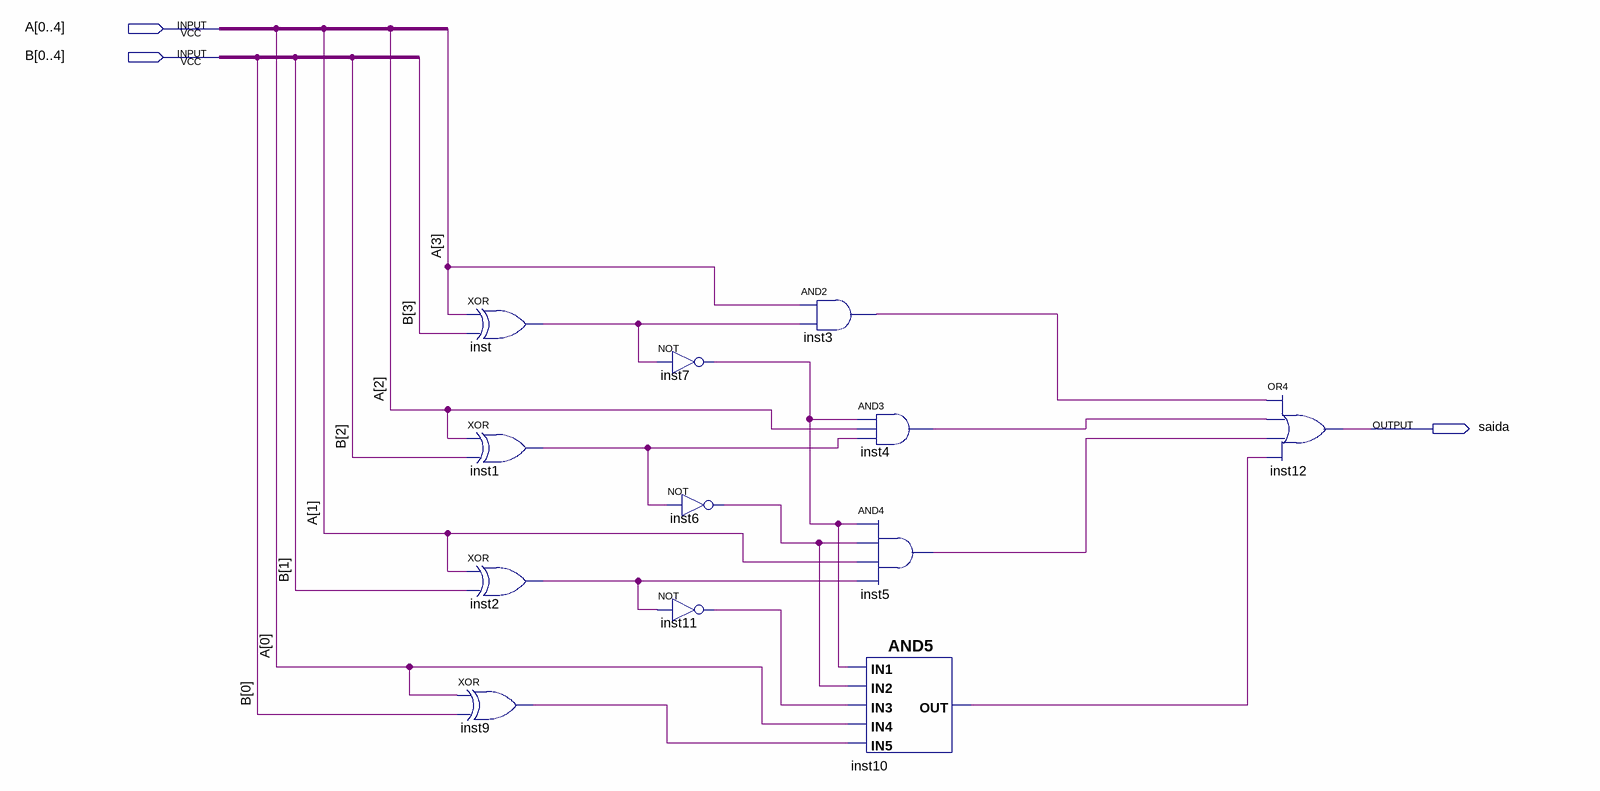
[diagram p0: schematic sheet]
// Quartus schematic Block2.bdf as structural Verilog: 12 symbols, 3 pins
module Block2 (
  input  [0:4] A,
  input  [0:4] B,
  output saida
);

  wire inst1_out, inst2_out, inst3_out, inst4_out, inst5_out, inst6_out, inst7_out, inst9_out, inst10_out,
       inst11_out, inst_out;

  xor inst (inst_out, A[3], B[3]);
  xor inst1 (inst1_out, A[2], B[2]);
  xor inst2 (inst2_out, A[1], B[1]);
  xor inst9 (inst9_out, A[0], B[0]);
  not inst7 (inst7_out, inst_out);
  not inst6 (inst6_out, inst1_out);
  not inst11 (inst11_out, inst2_out);
  and inst3 (inst3_out, A[3], inst_out);
  and inst4 (inst4_out, inst7_out, A[2], inst1_out);
  and inst5 (inst5_out, inst7_out, inst6_out, A[1], inst2_out);
  and inst10 (inst10_out, inst7_out, inst6_out, inst11_out, A[0], inst9_out);
  or inst12 (saida, inst3_out, inst4_out, inst5_out, inst10_out);
endmodule
